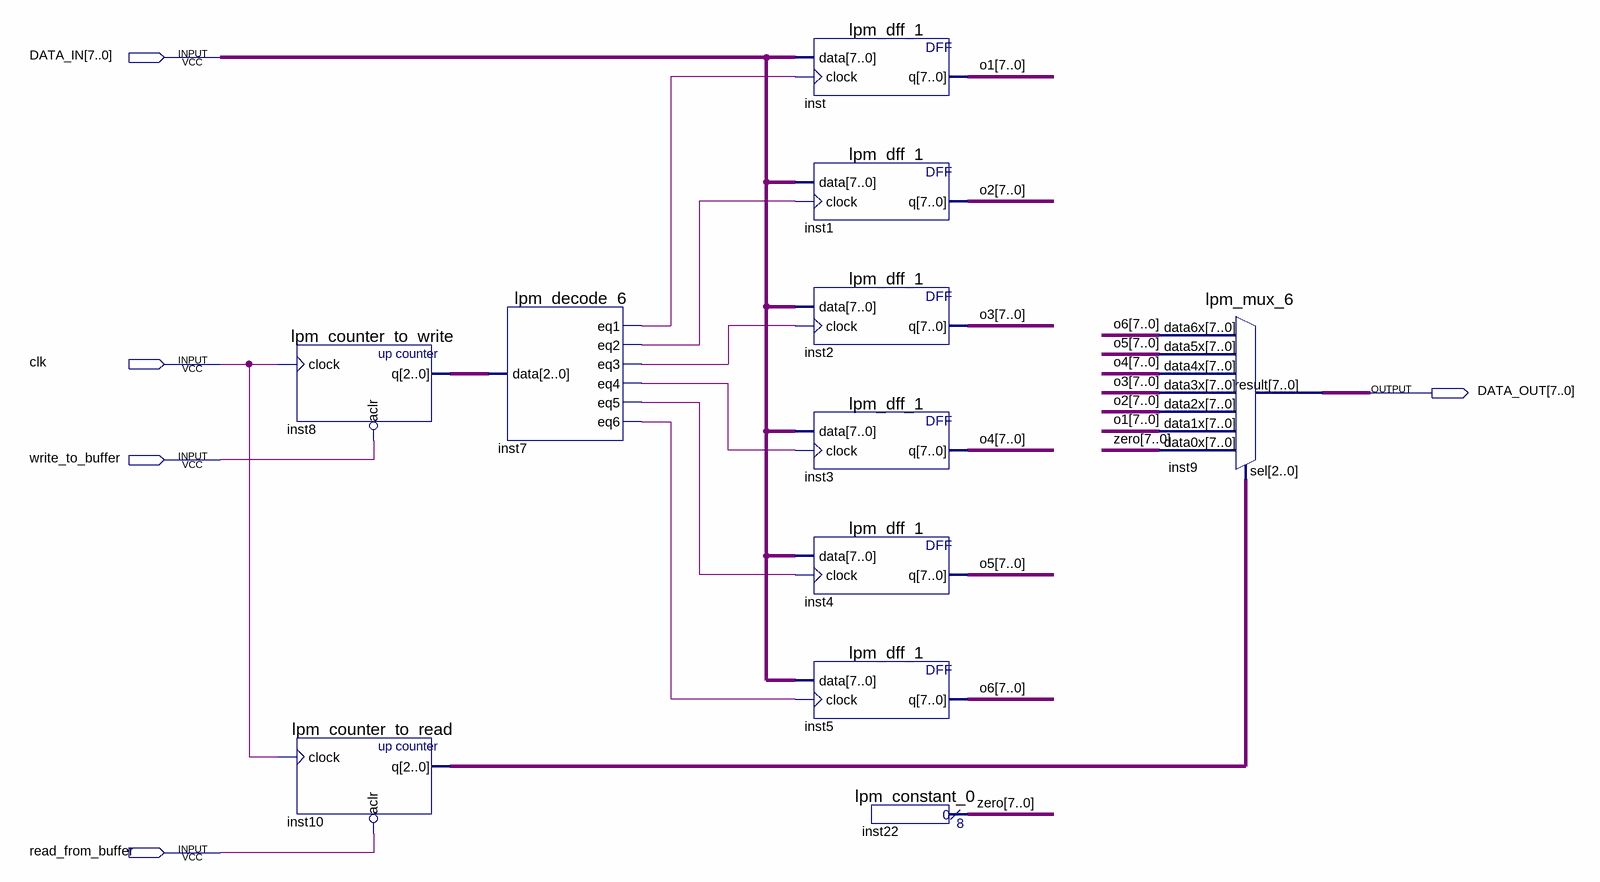
[diagram p0: schematic sheet]
// Quartus schematic buffer.bdf as structural Verilog: 11 symbols, 5 pins
module buffer (
  input  [7:0] DATA_IN,
  input  clk,
  input  write_to_buffer,
  input  read_from_buffer,
  output [7:0] DATA_OUT
);

  wire inst7_eq1, inst7_eq2, inst7_eq3, inst7_eq4, inst7_eq5, inst7_eq6;
  wire [2:0] inst8_q, inst10_q;
  wire [7:0] o1, o2, o3, o4, o5, o6, zero;

  lpm_counter_to_write inst8 (.clock(clk), .aclr(~write_to_buffer), .q(inst8_q));
  lpm_counter_to_read inst10 (.clock(clk), .aclr(~read_from_buffer), .q(inst10_q));
  lpm_decode_6 inst7 (
    .data(inst8_q), .eq1(inst7_eq1), .eq2(inst7_eq2), .eq3(inst7_eq3), .eq4(inst7_eq4), .eq5(inst7_eq5),
    .eq6(inst7_eq6));
  lpm_dff_1 inst (.data(DATA_IN), .clock(inst7_eq1), .q(o1));
  lpm_dff_1 inst1 (.data(DATA_IN), .clock(inst7_eq2), .q(o2));
  lpm_dff_1 inst2 (.data(DATA_IN), .clock(inst7_eq3), .q(o3));
  lpm_dff_1 inst3 (.data(DATA_IN), .clock(inst7_eq4), .q(o4));
  lpm_dff_1 inst4 (.data(DATA_IN), .clock(inst7_eq5), .q(o5));
  lpm_dff_1 inst5 (.data(DATA_IN), .clock(inst7_eq6), .q(o6));
  lpm_constant_0 inst22 (.result(zero));
  lpm_mux_6 inst9 (
    .data6x(o6), .data5x(o5), .data4x(o4), .data3x(o3), .data2x(o2), .data1x(o1), .data0x(zero),
    .sel(inst10_q), .result(DATA_OUT));
endmodule
